# Altium schematic sheet Sheet3.SchDoc
size 297 x 420 mm; Scale: 1:1; Разраб.: Тимофеев; Обозначение документа: 0000-00-00-001 Э5; Пров.: Тимофеев; Наименование организации: TSL; Перв. применение: 0000-00-00-001; Наименование изделия 1: WELDER; Наименование изделия 2: Схема электрическая; Наименование изделия 3: подключения; Нач. отд.: Нач. отд.
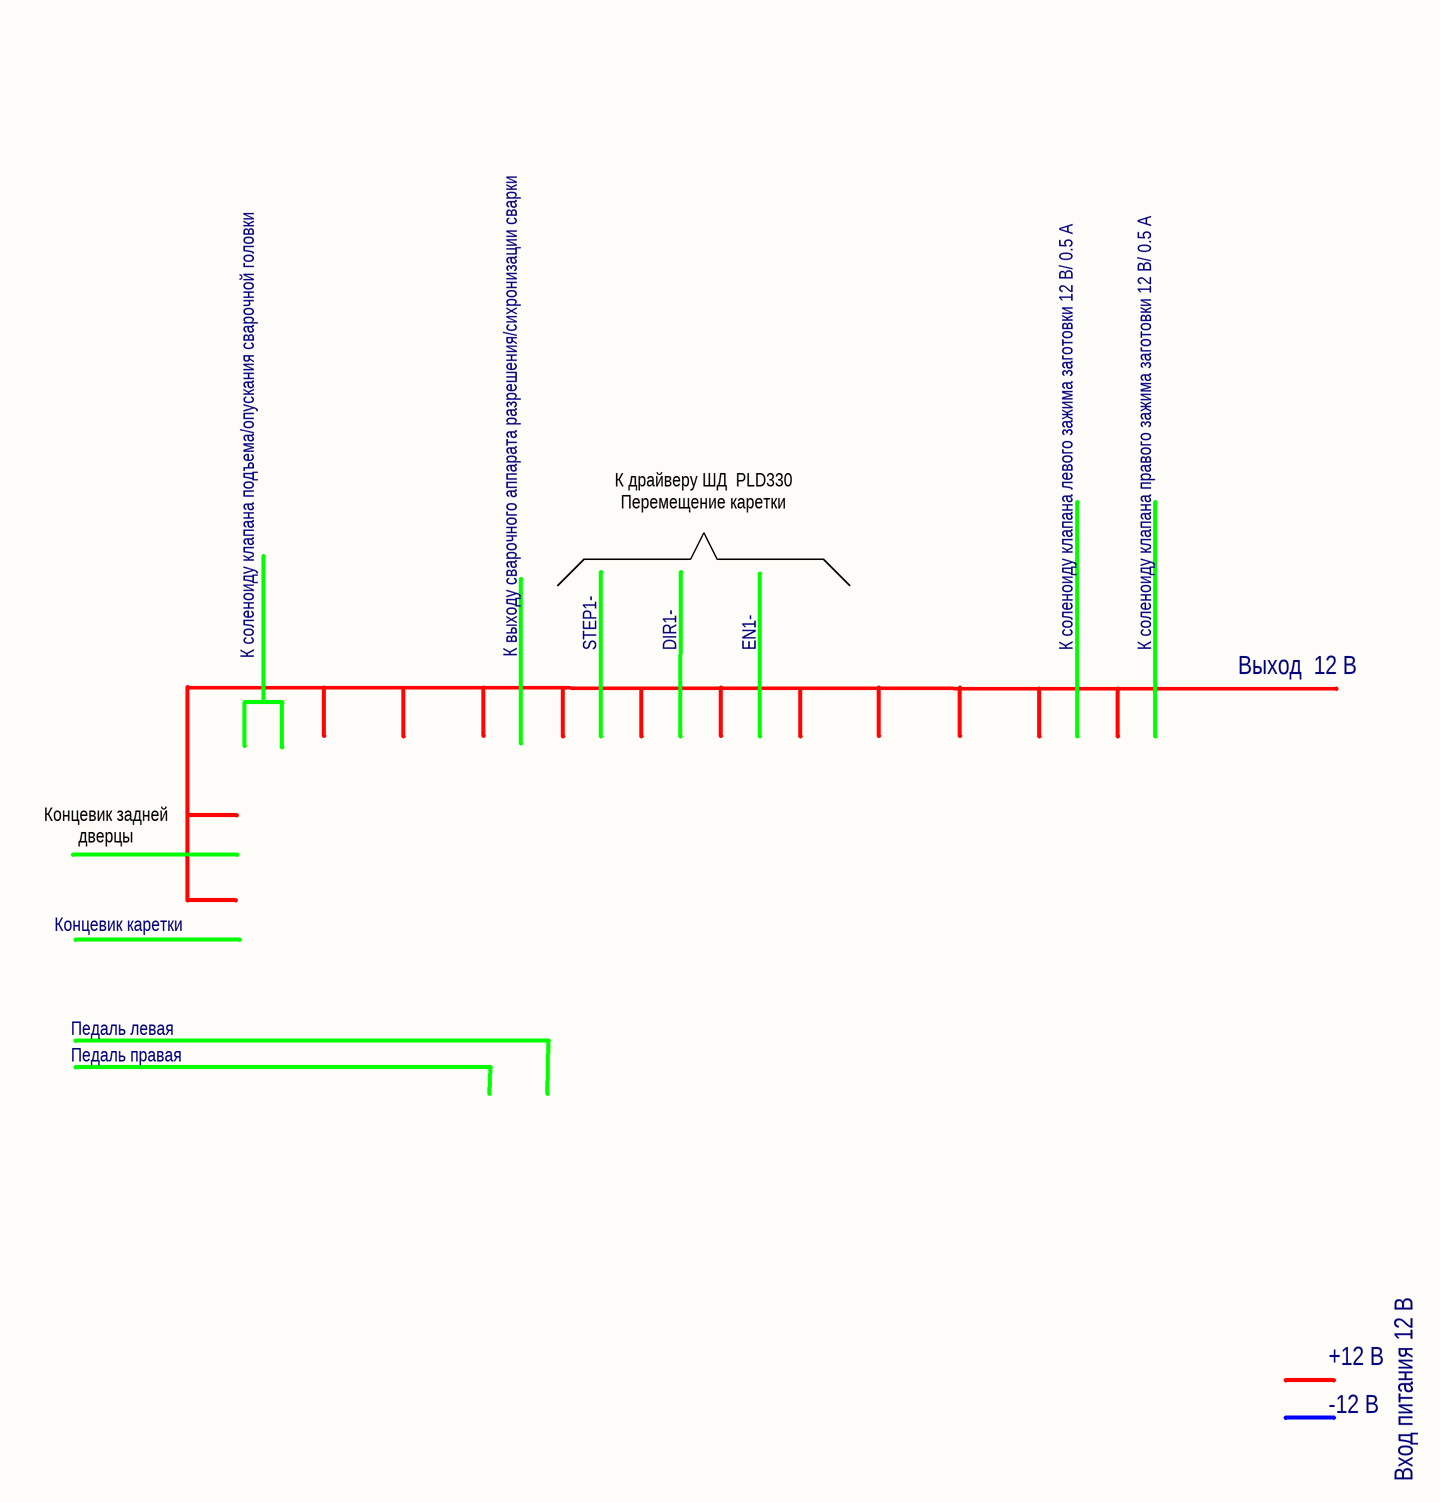
[diagram p0: Sheet3.SchDoc]

## Notes on the sheet
- К драйверу ШД  PLD330
  Перемещение каретки
- К соленоиду клапана подъема/опускания сварочной головки
- К выходу сварочного аппарата разрешения/сихронизации сварки
- STEP1-
- DIR1-
- EN1-
- К соленоиду клапана левого зажима заготовки 12 В/ 0.5 А
- К соленоиду клапана правого зажима заготовки 12 В/ 0.5 А
- Выход  12 В
- Концевик задней дверцы
- Концевик каретки
- Педаль левая
- Педаль правая
- +12 В
- -12 В
- Вход питания 12 В
- Перв. примен.
- Справ. №
- Подп. и дата
- Инв. № дубл.
- Взам. инв. №
- Разраб.
- Изм.
- Лист
- № докум.
- Подп.
- Дата
- Лит.
- Масса
- Масштаб
- Пров.
- Т.контр.
- Листов
- Инв. № подл.
- Утв.
- Н.контр.
- Копировал
- Формат А3